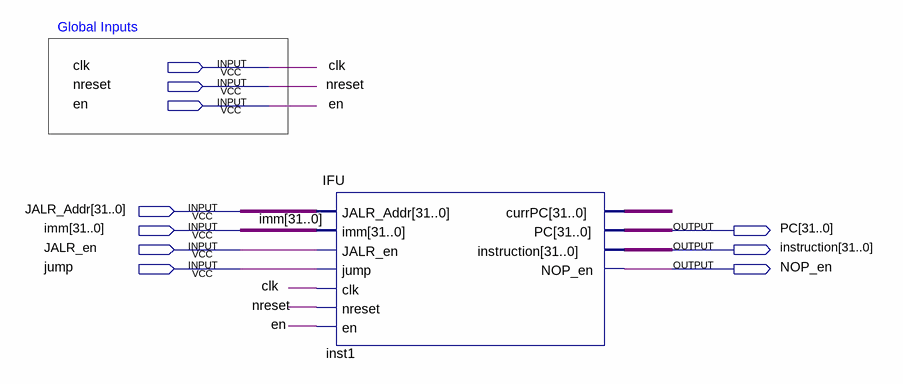
[diagram p0: schematic sheet]
// Quartus schematic testIFU_pipeline.bdf as structural Verilog: 1 symbols, 10 pins
module testIFU_pipeline (
  input  clk,
  input  nreset,
  input  en,
  input  [31:0] JALR_Addr,
  input  [31:0] imm,
  input  JALR_en,
  input  jump,
  output [31:0] PC,
  output [31:0] instruction,
  output NOP_en
);

  wire [31:0] inst1_currpc;

  IFU inst1 (
    .JALR_Addr(JALR_Addr), .imm(imm), .JALR_en(JALR_en), .jump(jump), .clk(clk), .nreset(nreset), .en(en),
    .currPC(inst1_currpc), .PC(PC), .instruction(instruction), .NOP_en(NOP_en));

  // Notes on the sheet:
  //   Global Inputs
endmodule
